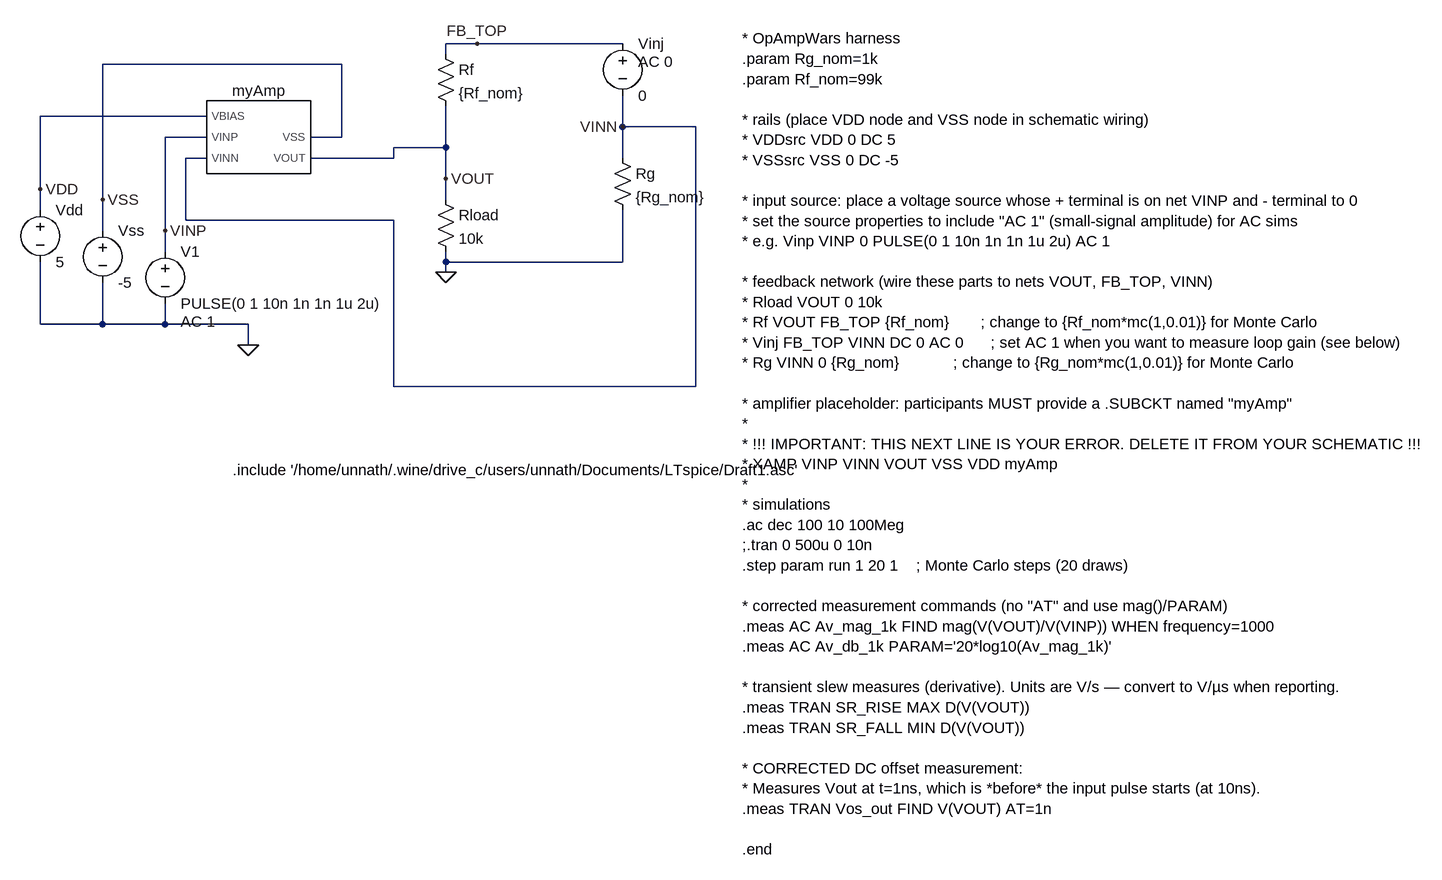
[diagram p0: schematic test.asc]
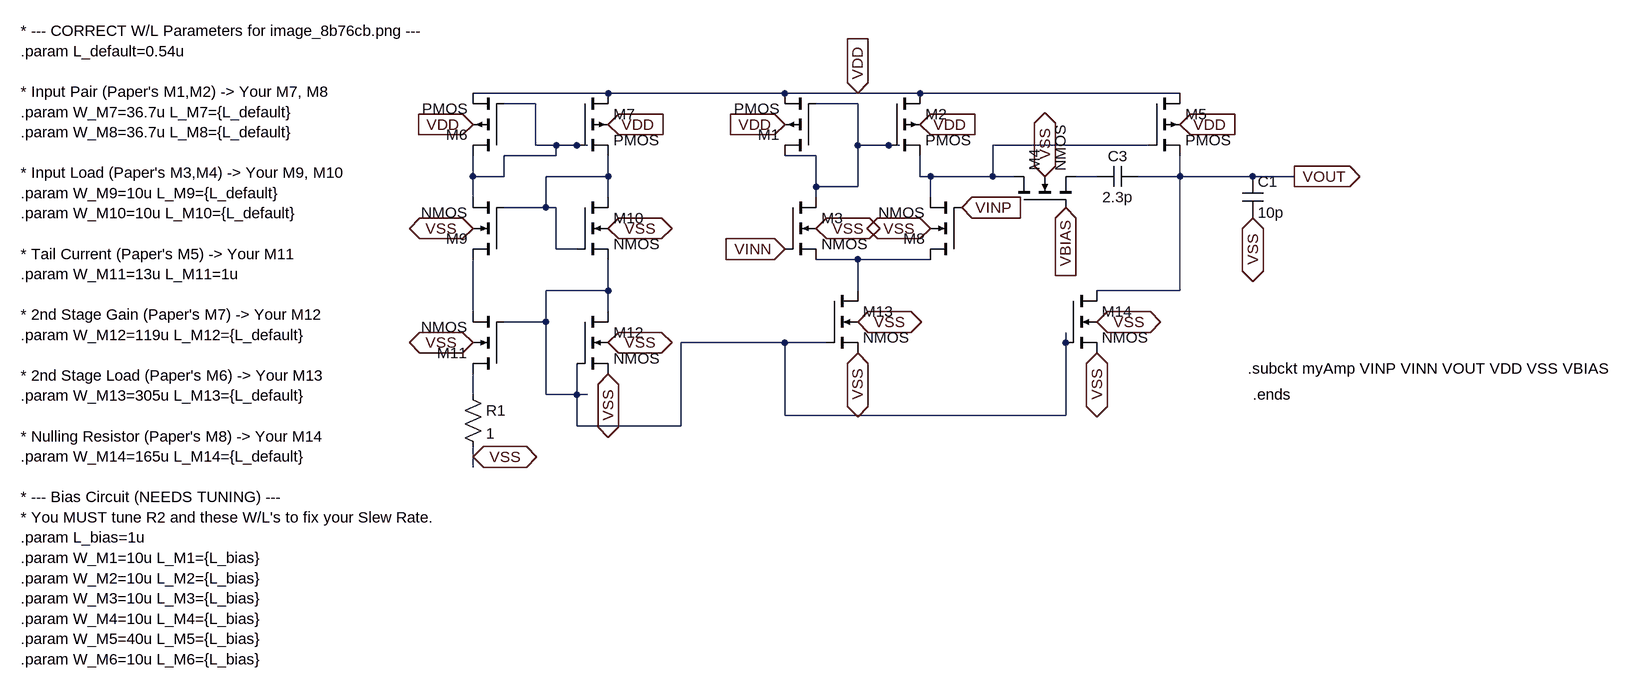
[diagram p1: sub-circuit draft1.asc]
test.asc, the LTspice schematic file:
Version 4.1
SHEET 1 3004 2024
WIRE 576 -240 528 -240
WIRE 800 -240 576 -240
WIRE 528 -224 528 -240
WIRE 368 -208 0 -208
WIRE 160 -128 -96 -128
WIRE 800 -112 800 -160
WIRE 912 -112 800 -112
WIRE 160 -96 96 -96
WIRE 368 -96 368 -208
WIRE 368 -96 320 -96
WIRE 528 -80 528 -144
WIRE 528 -80 448 -80
WIRE 160 -64 128 -64
WIRE 448 -64 448 -80
WIRE 448 -64 320 -64
WIRE 800 -64 800 -112
WIRE 528 -32 528 -80
WIRE -96 -16 -96 -128
WIRE 0 0 0 -208
WIRE 528 0 528 -32
WIRE -96 16 -96 -16
WIRE 128 32 128 -64
WIRE 448 32 128 32
WIRE 0 48 0 0
WIRE 96 48 96 -96
WIRE 96 80 96 48
WIRE 528 96 528 80
WIRE 800 96 800 16
WIRE 800 96 528 96
WIRE 528 112 528 96
WIRE -96 192 -96 96
WIRE 0 192 0 128
WIRE 0 192 -96 192
WIRE 96 192 96 160
WIRE 96 192 0 192
WIRE 224 192 96 192
WIRE 224 224 224 192
WIRE 448 288 448 32
WIRE 912 288 912 -112
WIRE 912 288 448 288
FLAG 224 224 0
FLAG -96 -16 VDD
FLAG 0 0 VSS
FLAG 96 48 VINP
FLAG 528 112 0
FLAG 528 -32 VOUT
FLAG 576 -240 FB_TOP
FLAG 800 -112 VINN
SYMBOL voltage 96 64 R0
WINDOW 123 24 124 Left 2
WINDOW 39 0 0 Left 0
SYMATTR Value2 AC 1
SYMATTR InstName V1
SYMATTR Value PULSE(0 1 10n 1n 1n 1u 2u)
SYMBOL voltage 0 32 R0
WINDOW 123 0 0 Left 0
WINDOW 39 0 0 Left 0
SYMATTR InstName Vss
SYMATTR Value -5
SYMBOL voltage -96 0 R0
WINDOW 123 0 0 Left 0
WINDOW 39 0 0 Left 0
SYMATTR InstName Vdd
SYMATTR Value 5
SYMBOL res 512 -240 R0
SYMATTR InstName Rf
SYMATTR Value {Rf_nom}
SYMBOL res 784 -80 R0
SYMATTR InstName Rg
SYMATTR Value {Rg_nom}
SYMBOL res 512 -16 R0
SYMATTR InstName Rload
SYMATTR Value 10k
SYMBOL voltage 800 -256 R0
WINDOW 123 24 44 Left 2
WINDOW 39 0 0 Left 0
SYMATTR Value2 AC 0
SYMATTR InstName Vinj
SYMATTR Value 0
SYMBOL Draft1 240 -96 R0
SYMATTR InstName myAmp
TEXT 984 -248 Left 2 !* OpAmpWars harness\n.param Rg_nom=1k\n.param Rf_nom=99k\n \n* rails (place VDD node and VSS node in schematic wiring)\n* VDDsrc VDD 0 DC 5\n* VSSsrc VSS 0 DC -5\n \n* input source: place a voltage source whose + terminal is on net VINP and - terminal to 0\n* set the source properties to include "AC 1" (small-signal amplitude) for AC sims\n* e.g. Vinp VINP 0 PULSE(0 1 10n 1n 1n 1u 2u) AC 1\n \n* feedback network (wire these parts to nets VOUT, FB_TOP, VINN)\n* Rload VOUT 0 10k\n* Rf VOUT FB_TOP {Rf_nom}       ; change to {Rf_nom*mc(1,0.01)} for Monte Carlo\n* Vinj FB_TOP VINN DC 0 AC 0      ; set AC 1 when you want to measure loop gain (see below)\n* Rg VINN 0 {Rg_nom}            ; change to {Rg_nom*mc(1,0.01)} for Monte Carlo\n \n* amplifier placeholder: participants MUST provide a .SUBCKT named "myAmp"\n*\n* !!! IMPORTANT: THIS NEXT LINE IS YOUR ERROR. DELETE IT FROM YOUR SCHEMATIC !!!\n* XAMP VINP VINN VOUT VSS VDD myAmp\n*\n* simulations\n.ac dec 100 10 100Meg\n;.tran 0 500u 0 10n\n.step param run 1 20 1    ; Monte Carlo steps (20 draws)\n \n* corrected measurement commands (no "AT" and use mag()/PARAM)\n.meas AC Av_mag_1k FIND mag(V(VOUT)/V(VINP)) WHEN frequency=1000\n.meas AC Av_db_1k PARAM='20*log10(Av_mag_1k)'\n \n* transient slew measures (derivative). Units are V/s — convert to V/µs when reporting.\n.meas TRAN SR_RISE MAX D(V(VOUT))\n.meas TRAN SR_FALL MIN D(V(VOUT))\n \n* CORRECTED DC offset measurement:\n* Measures Vout at t=1ns, which is *before* the input pulse starts (at 10ns).\n.meas TRAN Vos_out FIND V(VOUT) AT=1n\n \n.end
TEXT 200 416 Left 2 !.include '/home/unnath/.wine/drive_c/users/unnath/Documents/LTspice/Draft1.asc'

draft1.asc, the sub-circuit schematic file:
Version 4.1
SHEET 1 1512 1464
WIRE -176 144 -384 144
WIRE 96 144 -176 144
WIRE 208 144 96 144
WIRE 304 144 208 144
WIRE 704 144 304 144
WIRE -288 160 -336 160
WIRE 208 160 144 160
WIRE -288 224 -288 160
WIRE -256 224 -288 224
WIRE -224 224 -256 224
WIRE -208 224 -224 224
WIRE 208 224 208 160
WIRE 256 224 208 224
WIRE 272 224 256 224
WIRE 656 224 416 224
WIRE -256 240 -256 224
WIRE -256 240 -336 240
WIRE 144 240 96 240
WIRE -384 272 -384 240
WIRE -336 272 -336 240
WIRE -336 272 -384 272
WIRE -176 272 -176 240
WIRE -176 272 -272 272
WIRE 304 272 304 240
WIRE 320 272 304 272
WIRE 416 272 416 224
WIRE 416 272 320 272
WIRE 448 272 416 272
WIRE 576 272 544 272
WIRE 704 272 704 240
WIRE 704 272 640 272
WIRE 816 272 704 272
WIRE 880 272 816 272
WIRE 144 288 144 240
WIRE 208 288 208 224
WIRE 208 288 144 288
WIRE -384 304 -384 272
WIRE -176 304 -176 272
WIRE 144 304 144 288
WIRE 320 304 320 272
WIRE -272 320 -272 272
WIRE -272 320 -336 320
WIRE -256 320 -272 320
WIRE -256 384 -256 320
WIRE -224 384 -256 384
WIRE 208 400 144 400
WIRE 320 400 208 400
WIRE -176 448 -176 400
WIRE -176 448 -272 448
WIRE 208 448 208 400
WIRE 704 448 704 272
WIRE 704 448 576 448
WIRE -384 480 -384 400
WIRE -176 480 -176 448
WIRE -272 496 -272 448
WIRE -272 496 -336 496
WIRE 96 528 -64 528
WIRE 160 528 96 528
WIRE 528 528 528 512
WIRE -384 608 -384 576
WIRE -272 608 -272 496
WIRE -224 608 -224 560
WIRE -224 608 -272 608
WIRE -208 608 -224 608
WIRE 96 640 96 528
WIRE 528 640 528 528
WIRE 528 640 96 640
WIRE -224 656 -224 608
WIRE -64 656 -64 528
WIRE -64 656 -224 656
WIRE -384 704 -384 688
WIRE -384 720 -384 704
FLAG 880 272 VOUT
IOPIN 880 272 Out
FLAG 576 544 VSS
IOPIN 576 544 BiDir
FLAG 208 544 VSS
IOPIN 208 544 BiDir
FLAG -176 576 VSS
IOPIN -176 576 BiDir
FLAG -384 704 VSS
IOPIN -384 704 BiDir
FLAG 96 384 VINN
IOPIN 96 384 In
FLAG 368 320 VINP
IOPIN 368 320 In
FLAG 528 320 VBIAS
IOPIN 528 320 In
FLAG 208 144 VDD
IOPIN 208 144 In
FLAG -384 192 VDD
IOPIN -384 192 In
FLAG -176 192 VDD
IOPIN -176 192 In
FLAG 96 192 VDD
IOPIN 96 192 In
FLAG 304 192 VDD
IOPIN 304 192 In
FLAG 704 192 VDD
IOPIN 704 192 In
FLAG -384 528 VSS
IOPIN -384 528 BiDir
FLAG -176 528 VSS
IOPIN -176 528 BiDir
FLAG 208 496 VSS
IOPIN 208 496 BiDir
FLAG 576 496 VSS
IOPIN 576 496 BiDir
FLAG -384 352 VSS
IOPIN -384 352 BiDir
FLAG -176 352 VSS
IOPIN -176 352 BiDir
FLAG 496 272 VSS
IOPIN 496 272 BiDir
FLAG 320 352 VSS
IOPIN 320 352 BiDir
FLAG 144 352 VSS
IOPIN 144 352 BiDir
FLAG 816 336 VSS
IOPIN 816 336 BiDir
SYMBOL pmos4 -224 144 R0
SYMATTR InstName M7
SYMATTR Value2 l={L_bias} w={W_M7}
SYMBOL nmos4 -224 304 R0
SYMATTR InstName M10
SYMATTR Value2 l={L_bias} w={W_M10}
SYMBOL nmos4 -224 480 R0
SYMATTR InstName M12
SYMATTR Value2 l={L_bias} w={W_M12}
SYMBOL pmos4 -336 240 R180
SYMATTR InstName M6
SYMATTR Value2 l={L_bias} w={W_M6}
SYMBOL nmos4 -336 400 R180
SYMATTR InstName M9
SYMATTR Value2 l={L_bias} w={W_M9}
SYMBOL nmos4 -336 576 R180
SYMATTR InstName M11
SYMATTR Value2 l={L_bias} w={W_M11}
SYMBOL pmos4 256 144 R0
SYMATTR InstName M2
SYMATTR Value2 l={L_default} w={W_M2}
SYMBOL pmos4 144 240 R180
SYMATTR InstName M1
SYMATTR Value2 l={L_default} w={W_M1}
SYMBOL nmos4 96 304 R0
SYMATTR InstName M3
SYMATTR Value2 l={L_default} w={W_M3}
SYMBOL nmos4 368 400 R180
SYMATTR InstName M8
SYMATTR Value2 l={L_default} w={W_M8}
SYMBOL nmos4 160 448 R0
SYMATTR InstName M13
SYMATTR Value2 l={L_M13} w={W_M13}
SYMBOL nmos4 528 448 R0
SYMATTR InstName M14
SYMATTR Value2 l={L_default} w={W_M14}
SYMBOL nmos4 448 320 R270
SYMATTR InstName M4
SYMATTR Value2 l={L_default} w={W_M4}
SYMBOL cap 640 256 R90
WINDOW 0 0 32 VBottom 2
WINDOW 3 32 32 VTop 2
SYMATTR InstName C3
SYMATTR Value 2.3p
SYMBOL pmos4 656 144 R0
SYMATTR InstName M5
SYMATTR Value2 l={L_default} w={W_M5}
SYMBOL res -400 592 R0
SYMATTR InstName R1
SYMATTR Value 1
SYMBOL cap 800 272 R0
SYMATTR InstName C1
SYMATTR Value 10p
TEXT 808 568 Left 2 !.subckt myAmp VINP VINN VOUT VDD VSS VBIAS
TEXT 816 608 Left 2 !.ends
TEXT -1080 48 Left 2 !* --- CORRECT W/L Parameters for image_8b76cb.png ---\n.param L_default=0.54u\n \n* Input Pair (Paper's M1,M2) -> Your M7, M8\n.param W_M7=36.7u L_M7={L_default}\n.param W_M8=36.7u L_M8={L_default}\n \n* Input Load (Paper's M3,M4) -> Your M9, M10\n.param W_M9=10u L_M9={L_default}\n.param W_M10=10u L_M10={L_default}\n \n* Tail Current (Paper's M5) -> Your M11\n.param W_M11=13u L_M11=1u\n \n* 2nd Stage Gain (Paper's M7) -> Your M12\n.param W_M12=119u L_M12={L_default}\n \n* 2nd Stage Load (Paper's M6) -> Your M13\n.param W_M13=305u L_M13={L_default}\n \n* Nulling Resistor (Paper's M8) -> Your M14\n.param W_M14=165u L_M14={L_default}\n \n* --- Bias Circuit (NEEDS TUNING) ---\n* You MUST tune R2 and these W/L's to fix your Slew Rate.\n.param L_bias=1u\n.param W_M1=10u L_M1={L_bias}\n.param W_M2=10u L_M2={L_bias}\n.param W_M3=10u L_M3={L_bias}\n.param W_M4=10u L_M4={L_bias}\n.param W_M5=40u L_M5={L_bias}\n.param W_M6=10u L_M6={L_bias}

The netlist it stands for:
* test.asc
V1 VINP 0 PULSE(0 1 10n 1n 1n 1u 2u) AC 1
Vss VSS 0 -5
Vdd VDD 0 5
Rf FB_TOP VOUT {Rf_nom}
Rg VINN 0 {Rg_nom}
Rload VOUT 0 10k
Vinj FB_TOP VINN 0 AC 0
X§myAmp VDD VINP VINN VSS VOUT draft1

* block symbol definitions
.subckt draft1 VBIAS VINP VINN VSS VOUT
M7 VDD N001 N004 VDD PMOS l={L_bias} w={W_M7}
M10 N004 N004 N007 VSS NMOS l={L_bias} w={W_M10}
M12 N007 N007 VSS VSS NMOS l={L_bias} w={W_M12}
M6 N001 N001 VDD VDD PMOS l={L_bias} w={W_M6}
M9 N008 N004 N001 VSS NMOS l={L_bias} w={W_M9}
M11 N009 N007 N008 VSS NMOS l={L_bias} w={W_M11}
M2 VDD N002 N003 VDD PMOS l={L_default} w={W_M2}
M1 N002 N002 VDD VDD PMOS l={L_default} w={W_M1}
M3 N002 VINN N006 VSS NMOS l={L_default} w={W_M3}
M8 N006 VINP N003 VSS NMOS l={L_default} w={W_M8}
M13 N006 N007 VSS VSS NMOS l={L_M13} w={W_M13}
M14 VOUT N007 VSS VSS NMOS l={L_default} w={W_M14}
M4 N003 VBIAS N005 VSS NMOS l={L_default} w={W_M4}
C3 VOUT N005 2.3p
M5 VDD N003 VOUT VDD PMOS l={L_default} w={W_M5}
R1 N009 VSS 1
C1 VOUT VSS 10p
.subckt myAmp VINP VINN VOUT VDD VSS VBIAS
.ends
* --- CORRECT W/L Parameters for image_8b76cb.png ---
.param L_default=0.54u
* Input Pair (Paper's M1,M2) -> Your M7, M8
.param W_M7=36.7u L_M7={L_default}
.param W_M8=36.7u L_M8={L_default}
* Input Load (Paper's M3,M4) -> Your M9, M10
.param W_M9=10u L_M9={L_default}
.param W_M10=10u L_M10={L_default}
* Tail Current (Paper's M5) -> Your M11
.param W_M11=13u L_M11=1u
* 2nd Stage Gain (Paper's M7) -> Your M12
.param W_M12=119u L_M12={L_default}
* 2nd Stage Load (Paper's M6) -> Your M13
.param W_M13=305u L_M13={L_default}
* Nulling Resistor (Paper's M8) -> Your M14
.param W_M14=165u L_M14={L_default}
* --- Bias Circuit (NEEDS TUNING) ---
* You MUST tune R2 and these W/L's to fix your Slew Rate.
.param L_bias=1u
.param W_M1=10u L_M1={L_bias}
.param W_M2=10u L_M2={L_bias}
.param W_M3=10u L_M3={L_bias}
.param W_M4=10u L_M4={L_bias}
.param W_M5=40u L_M5={L_bias}
.param W_M6=10u L_M6={L_bias}
.ends draft1

.model NMOS NMOS
.model PMOS PMOS
.lib standard.mos
* OpAmpWars harness
.param Rg_nom=1k
.param Rf_nom=99k
* rails (place VDD node and VSS node in schematic wiring)
* VDDsrc VDD 0 DC 5
* VSSsrc VSS 0 DC -5
* input source: place a voltage source whose + terminal is on net VINP and - terminal to 0
* set the source properties to include "AC 1" (small-signal amplitude) for AC sims
* e.g. Vinp VINP 0 PULSE(0 1 10n 1n 1n 1u 2u) AC 1
* feedback network (wire these parts to nets VOUT, FB_TOP, VINN)
* Rload VOUT 0 10k
* Rf VOUT FB_TOP {Rf_nom}       ; change to {Rf_nom*mc(1,0.01)} for Monte Carlo
* Vinj FB_TOP VINN DC 0 AC 0      ; set AC 1 when you want to measure loop gain (see below)
* Rg VINN 0 {Rg_nom}            ; change to {Rg_nom*mc(1,0.01)} for Monte Carlo
* amplifier placeholder: participants MUST provide a .SUBCKT named "myAmp"
*
* !!! IMPORTANT: THIS NEXT LINE IS YOUR ERROR. DELETE IT FROM YOUR SCHEMATIC !!!
* XAMP VINP VINN VOUT VSS VDD myAmp
*
* simulations
.ac dec 100 10 100Meg
;.tran 0 500u 0 10n
.step param run 1 20 1    ; Monte Carlo steps (20 draws)
* corrected measurement commands (no "AT" and use mag()/PARAM)
.meas AC Av_mag_1k FIND mag(V(VOUT)/V(VINP)) WHEN frequency=1000
.meas AC Av_db_1k PARAM='20*log10(Av_mag_1k)'
* transient slew measures (derivative). Units are V/s — convert to V/µs when reporting.
.meas TRAN SR_RISE MAX D(V(VOUT))
.meas TRAN SR_FALL MIN D(V(VOUT))
* CORRECTED DC offset measurement:
* Measures Vout at t=1ns, which is *before* the input pulse starts (at 10ns).
.meas TRAN Vos_out FIND V(VOUT) AT=1n
.end
.include '/home/unnath/.wine/drive_c/users/unnath/Documents/LTspice/Draft1.asc'
.backanno
.end